# Altium schematic sheet Project_Board.SchDoc
size B
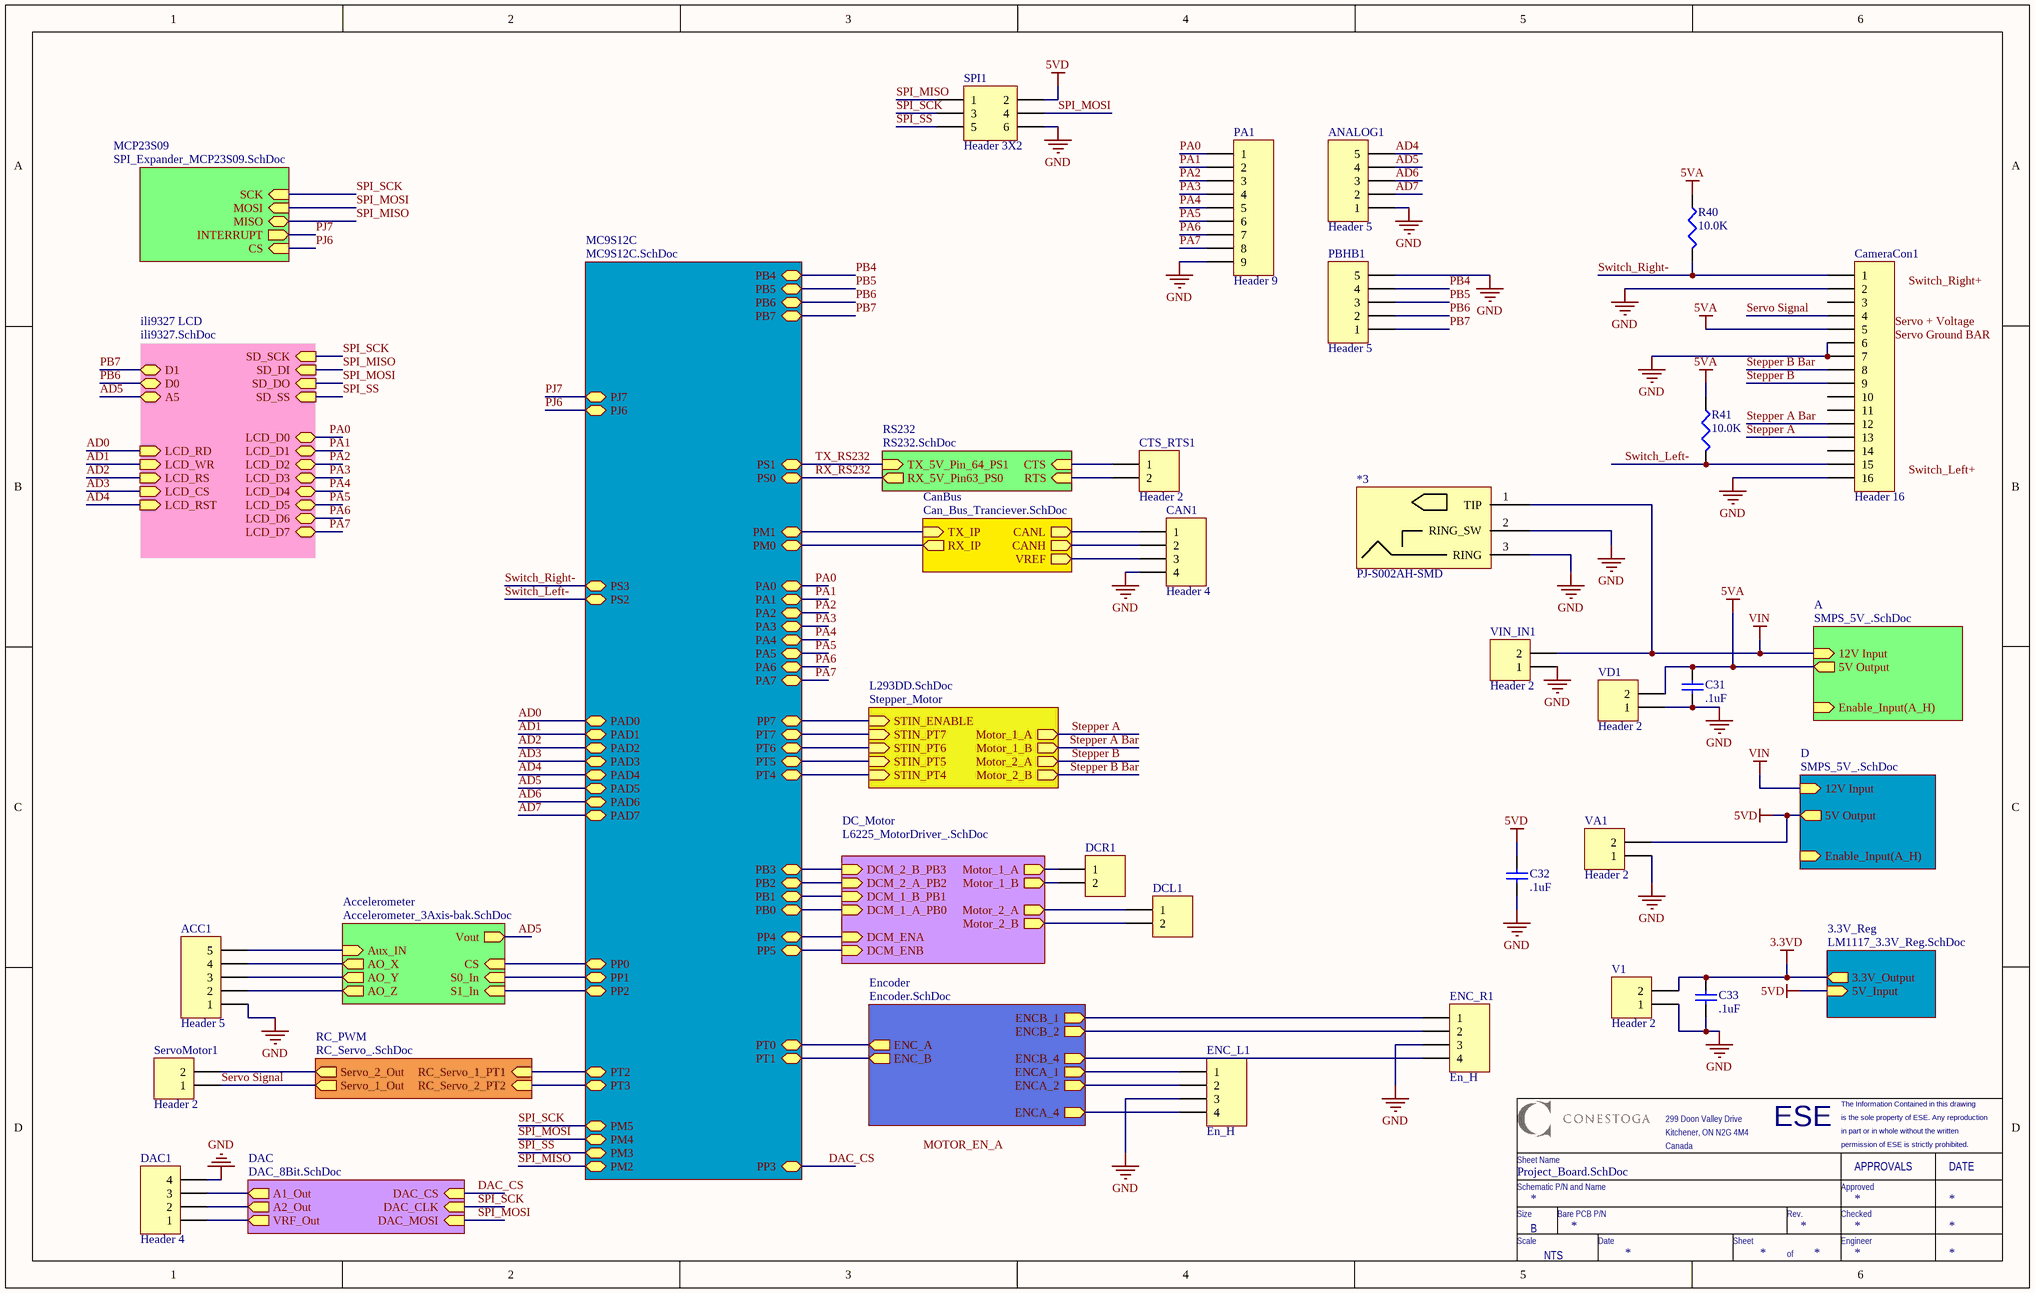
[diagram p0: Project_Board.SchDoc]

## Parts
*3  PJ-S002AH-SMD  [PJ-002AH-SMD]
ACC1  Header 5  [HDR1X5]
ANALOG1  Header 5  [HDR1X5]
C31  value .1uF  [CAPC2012X09M]  (hidden comment: Cap)
C32  value .1uF  [CAPC2012X09M]  (hidden comment: Cap)
C33  value .1uF  [CAPC2012X09M]  (hidden comment: Cap)
CameraCon1  Header 16  [HDR1X16]
CAN1  Header 4  [HDR1X4]
CTS_RTS1  Header 2  [HDR1X2]
DAC1  Header 4  [HDR1X4]
DCL1  Header 2  [HDR1X2]  (value not drawn)
DCR1  Header 2  [HDR1X2]  (value not drawn)
ENC_L1  En_H  [HDR1X4]
ENC_R1  En_H  [HDR1X4]
PA1  Header 9  [HDR1X9]
PBHB1  Header 5  [HDR1X5]
R40  value 10.0K  [RESC2112X05M]  (hidden comment: Res3)
R41  value 10.0K  [RESC2112X05M]  (hidden comment: Res3)
ServoMotor1  Header 2  [HDR1X2]
SPI1  Header 3X2  [HDR2X3]
V1  Header 2  [HDR1X2]
VA1  Header 2  [HDR1X2]
VD1  Header 2  [HDR1X2]
VIN_IN1  Header 2  [HDR1X2]

## Sub-sheets
3.3V_Reg = LM1117_3.3V_Reg.SchDoc: 3.3V_Output (out), 5V_Input (in)
A = SMPS_5V_.SchDoc: 5V Output (out), 12V Input (in), Enable_Input(A_H) (in)
Accelerometer = Accelerometer_3Axis-bak.SchDoc: AO_X (out), AO_Y (out), AO_Z (out), Aux_IN (in), S1_In (in), S0_In (in), CS (in), Vout (out)
CanBus = Can_Bus_Tranciever.SchDoc: TX_IP (in), CANH (out), CANL (out), RX_IP (out), VREF (out)
D = SMPS_5V_.SchDoc: 5V Output (out), 12V Input (in), Enable_Input(A_H) (in)
DAC = DAC_8Bit.SchDoc: A1_Out (out), A2_Out (out), VRF_Out (out), DAC_CS (in), DAC_CLK (in), DAC_MOSI (in)
DC_Motor = L6225_MotorDriver_.SchDoc: Motor_1_A (out), Motor_1_B (out), Motor_2_A (out), Motor_2_B (out), DCM_2_B_PB3 (in), DCM_2_A_PB2 (in), DCM_1_B_PB1 (in), DCM_1_A_PB0 (in), DCM_ENA (in), DCM_ENB (in)
Encoder = Encoder.SchDoc: ENCB_1 (out), ENCB_2 (out), ENCB_4 (out), ENCA_1 (out), ENCA_2 (out), ENCA_4 (out), ENC_A (out), ENC_B (out)
ili9327 LCD = ili9327.SchDoc: SD_SS (in), SD_DI (in), SD_DO (in), SD_SCK (in), LCD_RST (in), LCD_RD (in), LCD_WR (in), LCD_RS (in), LCD_CS (in), LCD_D2, LCD_D3, LCD_D4, LCD_D5, LCD_D6, LCD_D7, LCD_D0, LCD_D1, D1, D0, A5
MC9S12C = MC9S12C.SchDoc: PA0, PA1, PA2, PA3, PA4, PA5, PA6, PA7, PAD0, PAD1, PAD2, PAD3, PAD4, PAD5, PAD6, PAD7, PT0, PT1, PT2, PT3, PT4, PT5, PT6, PT7, PB0, PB1, PB2, PB3, PB4, PB5, PB6, PB7, PM0, PM1, PM2, PM3, PM4, PM5, PS0, PS1, PS2, PS3, PP0, PP1, PP2, PP3, PP4, PP5, PP7, PJ6, PJ7
MCP23S09 = SPI_Expander_MCP23S09.SchDoc: INTERRUPT (out), SCK (in), MOSI (in), MISO, CS (in)
RC_PWM = RC_Servo_.SchDoc: RC_Servo_2_PT2 (in), Servo_2_Out (out), Servo_1_Out (out), RC_Servo_1_PT1 (in)
RS232 = RS232.SchDoc: RTS (in), CTS (in), TX_5V_Pin_64_PS1 (in), RX_5V_Pin63_PS0 (out)
Stepper_Motor = L293DD.SchDoc: STIN_PT4 (in), STIN_PT5 (in), STIN_PT6 (in), STIN_PT7 (in), Motor_1_A (out), Motor_1_B (out), Motor_2_A (out), Motor_2_B (out), STIN_ENABLE (in)

## Nets
3.3VD: C33.2 V1.2 ; sheet 3.3V_Reg/3.3V_Output
5VA: C31.2 CameraCon1.5 R40.1 R41.1 VD1.2 ; sheet A/5V Output
5VD: C32.2 SPI1.2 VA1.2 ; sheet D/5V Output, sheet 3.3V_Reg/5V_Input
GND: *3.2(RING_SW) *3.3(RING) ACC1.1 ANALOG1.1 C31.1 C32.1 C33.1 CameraCon1.2 CameraCon1.6 CameraCon1.7 CameraCon1.16 CAN1.4 DAC1.4 ENC_L1.3 ENC_R1.3 PA1.9 PBHB1.5 SPI1.6 V1.1 VA1.1 VD1.1 VIN_IN1.1
VIN: *3.1(TIP) VIN_IN1.2 ; sheet A/12V Input, sheet D/12V Input
AD0: sheet ili9327 LCD/LCD_RD, sheet MC9S12C/PAD0
AD1: sheet ili9327 LCD/LCD_WR, sheet MC9S12C/PAD1
AD2: sheet ili9327 LCD/LCD_RS, sheet MC9S12C/PAD2
AD3: sheet ili9327 LCD/LCD_CS, sheet MC9S12C/PAD3
AD4: ANALOG1.5 ; sheet ili9327 LCD/LCD_RST, sheet MC9S12C/PAD4
AD5: ANALOG1.4 ; sheet Accelerometer/Vout, sheet ili9327 LCD/A5, sheet MC9S12C/PAD5
AD6: ANALOG1.3 ; sheet MC9S12C/PAD6
AD7: ANALOG1.2 ; sheet MC9S12C/PAD7
DAC_CS: sheet DAC/DAC_CS, sheet MC9S12C/PP3
PA0: PA1.1 ; sheet ili9327 LCD/LCD_D0, sheet MC9S12C/PA0
PA1: PA1.2 ; sheet ili9327 LCD/LCD_D1, sheet MC9S12C/PA1
PA2: PA1.3 ; sheet ili9327 LCD/LCD_D2, sheet MC9S12C/PA2
PA3: PA1.4 ; sheet ili9327 LCD/LCD_D3, sheet MC9S12C/PA3
PA4: PA1.5 ; sheet ili9327 LCD/LCD_D4, sheet MC9S12C/PA4
PA5: PA1.6 ; sheet ili9327 LCD/LCD_D5, sheet MC9S12C/PA5
PA6: PA1.7 ; sheet ili9327 LCD/LCD_D6, sheet MC9S12C/PA6
PA7: PA1.8 ; sheet ili9327 LCD/LCD_D7, sheet MC9S12C/PA7
PB4: PBHB1.4 ; sheet MC9S12C/PB4
PB5: PBHB1.3 ; sheet MC9S12C/PB5
PB6: PBHB1.2 ; sheet ili9327 LCD/D0, sheet MC9S12C/PB6
PB7: PBHB1.1 ; sheet ili9327 LCD/D1, sheet MC9S12C/PB7
PJ6: sheet MC9S12C/PJ6, sheet MCP23S09/CS
PJ7: sheet MC9S12C/PJ7, sheet MCP23S09/INTERRUPT
RX_RS232: sheet RS232/RX_5V_Pin63_PS0, sheet MC9S12C/PS0
Servo Signal: CameraCon1.4 ServoMotor1.1 ; sheet RC_PWM/Servo_1_Out
SPI_MISO: SPI1.1 ; sheet ili9327 LCD/SD_DI, sheet MC9S12C/PM2, sheet MCP23S09/MISO
SPI_MOSI: SPI1.4 ; sheet DAC/DAC_MOSI, sheet ili9327 LCD/SD_DO, sheet MC9S12C/PM4, sheet MCP23S09/MOSI
SPI_SCK: SPI1.3 ; sheet DAC/DAC_CLK, sheet ili9327 LCD/SD_SCK, sheet MC9S12C/PM5, sheet MCP23S09/SCK
SPI_SS: SPI1.5 ; sheet ili9327 LCD/SD_SS, sheet MC9S12C/PM3
Stepper A: CameraCon1.13 ; sheet Stepper_Motor/Motor_1_A
Stepper A Bar: CameraCon1.12 ; sheet Stepper_Motor/Motor_1_B
Stepper B: CameraCon1.9 ; sheet Stepper_Motor/Motor_2_A
Stepper B Bar: CameraCon1.8 ; sheet Stepper_Motor/Motor_2_B
Switch_Left-: CameraCon1.15 R41.2 ; sheet MC9S12C/PS2
Switch_Right-: CameraCon1.1 R40.2 ; sheet MC9S12C/PS3
TX_RS232: sheet RS232/TX_5V_Pin_64_PS1, sheet MC9S12C/PS1
NetACC1_2: ACC1.2 ; sheet Accelerometer/AO_Z
NetACC1_3: ACC1.3 ; sheet Accelerometer/AO_Y
NetACC1_4: ACC1.4 ; sheet Accelerometer/AO_X
NetACC1_5: ACC1.5 ; sheet Accelerometer/Aux_IN
NetCAN1_1: CAN1.1 ; sheet CanBus/CANL
NetCAN1_2: CAN1.2 ; sheet CanBus/CANH
NetCAN1_3: CAN1.3 ; sheet CanBus/VREF
NetCTS_RTS1_1: CTS_RTS1.1 ; sheet RS232/CTS
NetCTS_RTS1_2: CTS_RTS1.2 ; sheet RS232/RTS
NetDAC1_1: DAC1.1 ; sheet DAC/VRF_Out
NetDAC1_2: DAC1.2 ; sheet DAC/A2_Out
NetDAC1_3: DAC1.3 ; sheet DAC/A1_Out
NetDCL1_1: DCL1.1 ; sheet DC_Motor/Motor_2_A
NetDCL1_2: DCL1.2 ; sheet DC_Motor/Motor_2_B
NetDCR1_1: DCR1.1 ; sheet DC_Motor/Motor_1_A
NetDCR1_2: DCR1.2 ; sheet DC_Motor/Motor_1_B
NetENC_L1_1: ENC_L1.1 ; sheet Encoder/ENCA_1
NetENC_L1_2: ENC_L1.2 ; sheet Encoder/ENCA_2
NetENC_L1_4: ENC_L1.4 ; sheet Encoder/ENCA_4
NetENC_R1_1: ENC_R1.1 ; sheet Encoder/ENCB_1
NetENC_R1_2: ENC_R1.2 ; sheet Encoder/ENCB_2
NetENC_R1_4: ENC_R1.4 ; sheet Encoder/ENCB_4
NetServoMotor1_2: ServoMotor1.2 ; sheet RC_PWM/Servo_2_Out
(unnamed): sheet CanBus/TX_IP, sheet MC9S12C/PM1
(unnamed): sheet CanBus/RX_IP, sheet MC9S12C/PM0
(unnamed): sheet DC_Motor/DCM_2_B_PB3, sheet MC9S12C/PB3
(unnamed): sheet DC_Motor/DCM_2_A_PB2, sheet MC9S12C/PB2
(unnamed): sheet DC_Motor/DCM_1_B_PB1, sheet MC9S12C/PB1
(unnamed): sheet DC_Motor/DCM_1_A_PB0, sheet MC9S12C/PB0
(unnamed): sheet DC_Motor/DCM_ENA, sheet MC9S12C/PP4
(unnamed): sheet DC_Motor/DCM_ENB, sheet MC9S12C/PP5
(unnamed): sheet Stepper_Motor/STIN_PT4, sheet MC9S12C/PT4
(unnamed): sheet Stepper_Motor/STIN_PT5, sheet MC9S12C/PT5
(unnamed): sheet Stepper_Motor/STIN_PT6, sheet MC9S12C/PT6
(unnamed): sheet Stepper_Motor/STIN_PT7, sheet MC9S12C/PT7
(unnamed): sheet Stepper_Motor/STIN_ENABLE, sheet MC9S12C/PP7
(unnamed): sheet RC_PWM/RC_Servo_2_PT2, sheet MC9S12C/PT3
(unnamed): sheet RC_PWM/RC_Servo_1_PT1, sheet MC9S12C/PT2
(unnamed): sheet Accelerometer/S1_In, sheet MC9S12C/PP2
(unnamed): sheet Accelerometer/S0_In, sheet MC9S12C/PP1
(unnamed): sheet Accelerometer/CS, sheet MC9S12C/PP0
(unnamed): sheet MC9S12C/PT0, sheet Encoder/ENC_A
(unnamed): sheet MC9S12C/PT1, sheet Encoder/ENC_B

Not connected (* = marked no-connect by the designer): CameraCon1 3 10 11 14

## Notes on the sheet
- Labels drawn without touching a wire or pin: MOTOR_EN_A, Servo + Voltage, Servo Ground BAR, Switch_Left+, Switch_Right+
- ESE
- is the sole property of ESE. Any reproduction
- The Information Contained in this drawing
- Schematic P/N and Name
- Sheet Name
- 299 Doon Valley Drive
- Kitchener, ON N2G 4M4
- Canada
- Approved
- in part or in whole without the written
- permission of ESE is strictly prohibited.
- APPROVALS
- DATE
- Size
- Scale
- B
- NTS
- Bare PCB P/N
- Date
- Sheet
- Rev.
- Checked
- Engineer
- of

## Library data of the parts
ACC1 ANALOG1 PBHB1 = Header 5: Header, 5-Pin; LatestRevisionDate: 17-Jul-2002; LatestRevisionNote: Re-released for DXP Platform.; Publisher: Altium Limited
C31-C33 = CAP-Z5U-.1uF-50V-±20%: CAP CER .1uF 50v Z5U 0805; MPN: C0805C104M5UACTU; WV: 50; Tolerance: ±20%; PN: 399-1176-1-ND; Name: CAP-Z5U-.1uF-50V-±20%; Type: Z5U; URL: http://www.digikey.ca/product-detail/en/C0805C104M5UACTU/399-1176-1-ND
CameraCon1 = Header 16: Header, 16-Pin; LatestRevisionDate: 17-Jul-2002; LatestRevisionNote: Re-released for DXP Platform.; Publisher: Altium Limited
CAN1 DAC1 ENC_L1 ENC_R1 = Header 4: Header, 4-Pin; LatestRevisionDate: 17-Jul-2002; LatestRevisionNote: Re-released for DXP Platform.; Publisher: Altium Limited
CTS_RTS1 ServoMotor1 V1 VA1 VD1 VIN_IN1 = Header 2: Header, 2-Pin; PN: S1212E-02-ND; URL: http://www.digikey.ca/product-detail/en/PEC04SFAN/S1212E-02-ND
DCL1 DCR1 = Header 2: Header, 2-Pin; MPN: PEC02SFAN; PN: S1212E-02-ND; URL: http://www.digikey.ca/product-detail/en/PEC04SFAN/S1212E-02-ND
PA1 = Header 9: Header, 9-Pin; LatestRevisionDate: 17-Jul-2002; LatestRevisionNote: Re-released for DXP Platform.; Publisher: Altium Limited
R40 R41 = Resistor_10.0K: RES SMD 10.0K OHM 1% 1/8W 0805; MPN: CRCW080510K0FKEA; PN: 541-10.0KCCT-ND; Name: Resistor_10.0K; URL: http://www.digikey.ca/product-detail/en/CRCW080510K0FKEA/541-10.0KCCT-ND
SPI1 = Header 3X2: Header, 3-Pin, Dual row; LatestRevisionDate: 17-Jul-2002; LatestRevisionNote: Re-released for DXP Platform.; Publisher: Altium Limited
*3 = PJ-S002AH-SMD: URL: http://www.digikey.com/product-detail/en/PJ-002AH-SMT-TR/CP-002AHPJCT-ND/669692